# Altium schematic sheet HIVE_BOARD_WIRELESS.SchDoc
size Tabloid; SheetNumber: 11; SheetTotal: 12; Sheet_Name: WIRELESS; Size: 11x17
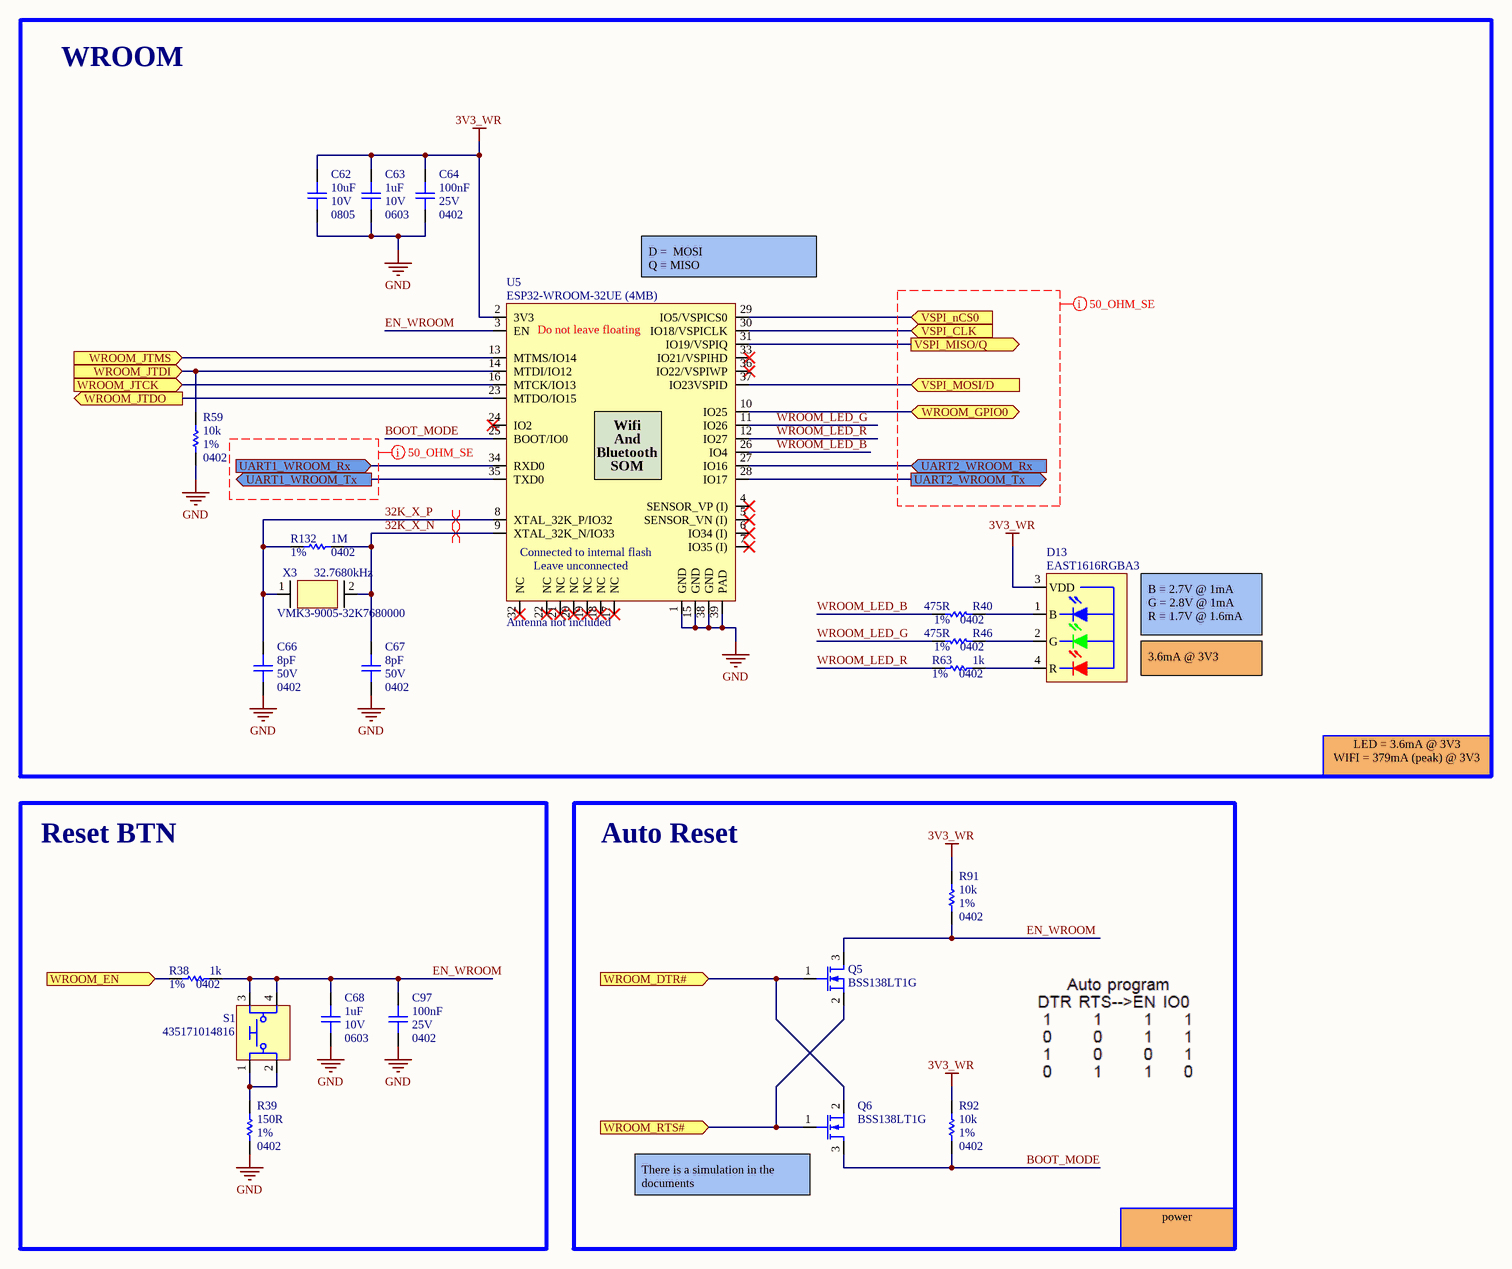
[diagram p0: HIVE_BOARD_WIRELESS.SchDoc]

## Parts
C62  value 10uF  Package: 0805  Voltage Rating: 10V  [CAP_CER_0805]  (hidden comment: LMK212BJ106KG-T)
C63  value 1uF  Package: 0603  Voltage Rating: 10V  [CAP_CER_0603]  (hidden comment: C0603C105K8PACTU)
C64  value 100nF  Package: 0402  Voltage Rating: 25V  [CAP_CER_0402]  (hidden comment: CGA2B3X7R1E104K050BB)
C66  value 8pF  Package: 0402  Voltage Rating: 50V  [CAP_CER_0402]  (hidden comment: CC0402DRNPO9BN8R0)
C67  value 8pF  Package: 0402  Voltage Rating: 50V  [CAP_CER_0402]  (hidden comment: CC0402DRNPO9BN8R0)
C68  value 1uF  Package: 0603  Voltage Rating: 10V  [CAP_CER_0603]  (hidden comment: C0603C105K8PACTU)
C97  value 100nF  Package: 0402  Voltage Rating: 25V  [CAP_CER_0402]  (hidden comment: CGA2B3X7R1E104K050BB)
D13  EAST1616RGBA3  [DIO_EAST1616RGBA3]
Q5  BSS138LT1G  [TRX_NMOS_BSS138LT1G]
Q6  BSS138LT1G  [TRX_NMOS_BSS138LT1G]
R38  value 1k  Tolerance: 1%  Package: 0402  [RES_0402]  (hidden comment: RC0402FR-071KL)
R39  value 150R  Tolerance: 1%  Package: 0402  [RES_0402]  (hidden comment: RC0402FR-07150RL)
R40  value 475R  Tolerance: 1%  Package: 0402  [RES_0402]  (hidden comment: ERJ-2RKF4750X)
R46  value 475R  Tolerance: 1%  Package: 0402  [RES_0402]  (hidden comment: ERJ-2RKF4750X)
R59  value 10k  Tolerance: 1%  Package: 0402  [RES_0402]  (hidden comment: RC0402FR-0710KL)
R63  value 1k  Tolerance: 1%  Package: 0402  [RES_0402]  (hidden comment: RC0402FR-071KL)
R91  value 10k  Tolerance: 1%  Package: 0402  [RES_0402]  (hidden comment: RC0402FR-0710KL)
R92  value 10k  Tolerance: 1%  Package: 0402  [RES_0402]  (hidden comment: RC0402FR-0710KL)
R132  value 1M  Tolerance: 1%  Package: 0402  [RES_0402]  (hidden comment: RC0402FR-071ML)
S1  435171014816  [SWI_TACT_435171014816]
U5  ESP32-WROOM-32UE (4MB)  Note: Antenna not included  [COM_ESP32-WROOM-32UE(8MB)]
X3  VMK3-9005-32K7680000  value 32.7680kHz  [CRY_VMK3-9005-32K7680000]

## Blocks framed on the sheet
WROOM: C62-C64 C66 C67 D13 R40 R46 R59 R63 R132 U5 X3
Reset BTN: C68 C97 R38 R39 S1
Auto Reset: Q5 Q6 R91 R92

## Ports
UART1_WROOM_Rx (in), UART1_WROOM_Tx (out), UART2_WROOM_Rx (in), UART2_WROOM_Tx (out), VSPI_CLK (in), VSPI_MISO/Q (out), VSPI_MOSI/D (in), VSPI_nCS0 (in), WROOM_DTR# (in), WROOM_EN (in), WROOM_GPIO0 (bidir), WROOM_JTCK (in), WROOM_JTDI (in), WROOM_JTDO (out), WROOM_JTMS (in), WROOM_RTS# (in)

## Nets
3V3_WR: C62.2 C63.1 C64.2 D13.3(VDD) R91.2 R92.2 U5.2(3V3)
GND: C62.1 C63.2 C64.1 C66.1 C67.1 C68.2 C97.1 R39.1 R59.1 U5.1(GND) U5.15(GND) U5.38(GND) U5.39(PAD)
32K_X_N: C67.2 R132.1 U5.9(XTAL_32K_N/IO33) X3.2(Out/In)
32K_X_P: C66.2 R132.2 U5.8(XTAL_32K_P/IO32) X3.1(In/Out)
BOOT_MODE: Q6.3(D) R92.1 U5.25(BOOT/IO0)
EN_WROOM: C68.1 C97.2 Q5.3(D) R38.1 R91.1 S1.3 S1.4 U5.3(EN)
UART1_WROOM_Rx: U5.34(RXD0) ; port UART1_WROOM_Rx
UART1_WROOM_Tx: U5.35(TXD0) ; port UART1_WROOM_Tx
UART2_WROOM_Rx: U5.27(IO16) ; port UART2_WROOM_Rx
UART2_WROOM_Tx: U5.28(IO17) ; port UART2_WROOM_Tx
VSPI_CLK: U5.30(IO18/VSPICLK) ; port VSPI_CLK
VSPI_MISO/Q: U5.31(IO19/VSPIQ) ; port VSPI_MISO/Q
VSPI_MOSI/D: U5.37(IO23VSPID) ; port VSPI_MOSI/D
VSPI_nCS0: U5.29(IO5/VSPICS0) ; port VSPI_nCS0
WROOM_DTR#: Q5.1(G) Q6.2(S) ; port WROOM_DTR#
WROOM_EN: R38.2 ; port WROOM_EN
WROOM_GPIO0: U5.10(IO25) ; port WROOM_GPIO0
WROOM_JTCK: U5.16(MTCK/IO13) ; port WROOM_JTCK
WROOM_JTDI: R59.2 U5.14(MTDI/IO12) ; port WROOM_JTDI
WROOM_JTDO: U5.23(MTDO/IO15) ; port WROOM_JTDO
WROOM_JTMS: U5.13(MTMS/IO14) ; port WROOM_JTMS
WROOM_LED_B: R40.2 U5.26(IO4)
WROOM_LED_G: R46.2 U5.11(IO26)
WROOM_LED_R: R63.2 U5.12(IO27)
WROOM_RTS#: Q5.2(S) Q6.1(G) ; port WROOM_RTS#
NetD13_1: D13.1(B) R40.1
NetD13_2: D13.2(G) R46.1
NetD13_4: D13.4(R) R63.1
NetR39_2: R39.2 S1.1 S1.2

Not connected (* = marked no-connect by the designer): U5 4(SENSOR_VP_(I))* 5(SENSOR_VN_(I))* 6(IO34_(I))* 7(IO35_(I))* 17(NC)* 18(NC)* 19(NC)* 20(NC)* 21(NC)* 22(NC)* 24(IO2)* 32(NC)* 33(IO21/VSPIHD)* 36(IO22/VSPIWP)*

## Layout directives
differential pair; differential pair class DIFF_100: 32K_X_N, 32K_X_P
net class SE_50: (no net found under the mark)

## Notes on the sheet
- (near U5) D =  MOSI
  Q = MISO
- B = 2.7V @ 1mA
  G = 2.8V @ 1mA
  R = 1.7V @ 1.6mA
- 3.6mA @ 3V3
- LED = 3.6mA @ 3V3
  WIFI = 379mA (peak) @ 3V3
- (near Q6) There is a simulation in the documents
- power
- Sheet Name
- Project Title
- Global Project
- Size
- Date
- Group
- Sheet
- Revision
- of
- PCB
- .
- SCH
- Filename
- Designers
- (in symbol COM_ESP32-WROOM-32UE(4MB)) Do not leave floating; Wifi; And; Bluetooth; SOM; Connected to internal flash; Leave unconnected

## Library data of the parts
C62 = CAP_CER_LMK212BJ106KG-T: CAP - CER 10UF 10% 10V X5R - 0805; Manufacturer #1: Taiyo Yuden; GRAMS Lib Spec: 2.8; Magnetic Material: Unknown; Polarized: NO; Assembly Type: SMD; CreatedBy/Date: Caroline Paulin / 25 juillet 2018; Current Rating: *; HelpURL: https://www.yuden.co.jp/productdata/catalog/mlcc_all_e.pdf; Manufacturer #2: *; Note: *; Part Number #1: LMK212BJ106KG-T; Part Number #2: *; Power Max: *; Temperature: -55°C ~ 85°C; Tolerance: 10%; VerifiedBy: Nicolas V. (2019-01-22); Supplier 1: Digi-Key; Supplier Part Number 1: 587-1300-1-ND; Cryo: UNKNOWN
C63 C68 = CAP_CER_C0603C105K8PACTU: CAP - CER 1uF 10V 10% X5R - 0603; Manufacturer #1: KEMET; GRAMS Lib Spec: 2.8; Magnetic Material: Unknown; Polarized: NO; Tolerance: 10%; Current Rating: *; Power Max: *; HelpURL: https://content.kemet.com/datasheets/KEM_C1006_X5R_SMD.pdf; CreatedBy/Date: Hubert Dube - 21/07/20; VerifiedBy: Louis-Daniel Gaulin - 21/07/20; Temperature: -55°C ~ 85°C; Manufacturer #2: *; Assembly Type: SMD; Part Number #2: *; Part Number #1: C0603C105K8PACTU; Cryo: UNKNOWN; Supplier 1: Digi-Key; Supplier Part Number 1: 399-3118-1-ND
C64 C97 = CAP_CER_CGA2B3X7R1E104K050BB: CAP - CER 0.1µF 10% 25V X7R - 0402; Manufacturer #1: TDK Corporation; GRAMS Lib Spec: 2.8; Magnetic Material: Unknown; Polarized: NO; Assembly Type: SMD; CreatedBy/Date: Nicolas Roy 2018-11-07; Current Rating: *; HelpURL: https://product.tdk.com/info/en/catalog/datasheets/mlcc_automotive_general_en.pdf; Manufacturer #2: *; Note: *; Part Number #1: CGA2B3X7R1E104K050BB; Part Number #2: *; Power Max: *; Temperature: -55°C ~ 125°C; Tolerance: 10%; VerifiedBy: Nicolas V. (2019-01-22); Supplier 1: Digi-Key; Supplier Part Number 1: 445-6902-1-ND; Cryo: UNKNOWN
C66 C67 = CAP_CER_CC0402DRNPO9BN8R0: CAP - CER 8PF 50V C0G/NP0 - 0402; Manufacturer #1: Yageo; Tolerance: ±0.5pF; GRAMS Lib Spec: 2.8; Magnetic Material: Unknown; Polarized: NO; Current Rating: *; Power Max: *; HelpURL: https://www.yageo.com/upload/media/product/productsearch/datasheet/mlcc/UPY-GP_NP0_16V-to-50V_18.pdf; CreatedBy/Date: Hubert Dube - 04/10/20; VerifiedBy: Louis-Daniel Gaulin - 09/11/2020; Temperature: -55°C ~ 125°C; Manufacturer #2: *; Assembly Type: SMD; Part Number #2: *; Part Number #1: CC0402DRNPO9BN8R0; Cryo: UNKNOWN; Supplier 1: Digi-Key; Supplier Part Number 1: 311-1639-1-ND
D13 = DIO_EAST1616RGBA3: DIO - Red, Green, Blue LED Indication - Discrete 1.95V Red, 2.8V Green, 2.8V Blue 0606 (1616 Metric); Manufacturer #1: Everlight Electronics Co Ltd; Value: 24MHz; Tolerance: ±50ppm; Voltage Rating: 1.8 to 3.3V; Current Rating: 60mA; Power Max: 60mW; GRAMS Lib Spec: 2.8; Magnetic Material: Unknown; Polarized: Yes; HelpURL: https://everlightamericas.com/index.php?controller=attachment&id_attachment=1010; CreatedBy/Date: Hubert Dube - 26/02/2021; VerifiedBy: PA + Hubert Dube - 19/03/2021; Temperature: -40 ~ +85℃; Package: 4-SMD, No Lead; Manufacturer #2: *; Note: *; Assembly Type: SMD; Part Number #2: *; Part Number #1: EAST1616RGBA3; Cryo: UNKNOWN; Supplier 1: Digi-Key; Supplier Part Number 1: 1080-1550-1-ND
Q5 Q6 = TRX_NMOS_BSS138LT1G: TRX - NMOS - 50V 200MA - SOT−23-3; Manufacturer #1: ON Semiconductor; GRAMS Lib Spec: 2.8; Magnetic Material: Unknown; Polarized: Yes; Power Max: 225mW; Assembly Type: SMD; CreatedBy/Date: Joel Lemay 2018-06-15; Current Rating: 200mA; HelpURL: http://www.onsemi.com/pub/Collateral/BSS138LT1-D.PDF; Manufacturer #2: *; Package: SOT-23-3; Part Number #1: BSS138LT1G; Part Number #2: *; Supplier 1: Digi-Key; Supplier Part Number 1: BSS138LT1GOSCT-ND; Temperature: -55°C ~ 150°C; Tolerance: *; Value: *; VerifiedBy: Caroline Paulin - 6 sept 2018; Voltage Rating: 50V; Cryo: UNKNOWN
R38 R63 = RES_RC0402FR-071KL: RES - 1K OHM 1% 1/16W - 0402; Manufacturer #1: Yageo; GRAMS Lib Spec: 2.8; Magnetic Material: YES; Polarized: NO; Voltage Rating: 50V; Cryo: UNKNOWN; Assembly Type: SMD; CreatedBy/Date: Jonathan Bouchard 2018-07-05; Current Rating: *; HelpURL: http://www.yageo.com/documents/recent/PYu-RC_Group_51_RoHS_L_9.pdf; Manufacturer #2: *; Note: *; Part Number #1: RC0402FR-071KL; Part Number #2: *; Power Max: 1/16W; Temperature: -55°C ~ 155°C; VerifiedBy: Arnaud Samson 16-07-18; Supplier 1: Digi-Key; Supplier Part Number 1: 311-1.00KLRCT-ND
R39 = RES_RC0402FR-07150RL: RES - 150R 1% 1/16W - 0402; Manufacturer #1: Yageo; GRAMS Lib Spec: 2.8; Magnetic Material: Unknown; Polarized: No; Voltage Rating: 50V; Assembly Type: SMD; CreatedBy/Date: Jonathan Bouchard 2019-03-25; Current Rating: *; HelpURL: http://www.yageo.com/documents/recent/PYu-RC_Group_51_RoHS_L_10.pdf; Manufacturer #2: *; Part Number #1: RC0402FR-07150RL; Part Number #2: *; Power Max: 1/16W; Temperature: -55°C ~ 155°C; VerifiedBy: Nicolas V. (2019-05-02); Supplier 1: Digi-Key; Supplier Part Number 1: 311-150LRCT-ND; Cryo: UNKNOWN
R40 R46 = RES_ERJ-2RKF4750X: RES - 475R 1% 1/10W- 0402; Manufacturer #1: Panasonic Electronic Components; GRAMS Lib Spec: 2.8; Power Max: 1/10W; Magnetic Material: Unknown; Polarized: No; Voltage Rating: 50V; Assembly Type: SMD; CreatedBy/Date: Keven Deslandes 2018-10-17; Current Rating: *; HelpURL: https://industrial.panasonic.com/cdbs/www-data/pdf/RDA0000/AOA0000C304.pdf; Manufacturer #2: *; Part Number #1: ERJ-2RKF4750X; Part Number #2: *; Temperature: -55°C ~ 155°C; VerifiedBy: Carolilne Paulin - 18/12/2018; Supplier 1: Digi-Key; Supplier Part Number 1: P475LCT-ND; Cryo: UNKNOWN
R59 R91 R92 = RES_RC0402FR-0710KL: RES - 10K OHMS 1% 1/16W - 0402; Manufacturer #1: Yageo; GRAMS Lib Spec: 2.8; Magnetic Material: UNKNOWN; Polarized: NO; Voltage Rating: 50V; Assembly Type: SMD; CreatedBy/Date: Nicolas V. (2018-11-20); Current Rating: *; HelpURL: http://www.yageo.com/documents/recent/PYu-RC_Group_51_RoHS_L_9.pdf; Manufacturer #2: *; Note: *; Part Number #1: RC0402FR-0710KL; Part Number #2: *; Power Max: 1/16W; Temperature: -55°C ~ 155°C; VerifiedBy: Nicolas V. (2018-11-20); Supplier 1: Digi-Key; Supplier Part Number 1: 311-10.0KLRCT-ND; Cryo: UNKNOWN
R132 = RES_RC0402FR-071ML: RES - 1M 1% 1/16W - 0402; Manufacturer #1: Yageo; GRAMS Lib Spec: 2.8; Magnetic Material: Unknown; Polarized: No; Voltage Rating: 50V; Assembly Type: SMD; CreatedBy/Date: Keven Deslandes 2018-11-09; Current Rating: *; HelpURL: http://www.yageo.com/documents/recent/PYu-RC_Group_51_RoHS_L_10.pdf; Manufacturer #2: *; Part Number #1: RC0402FR-071ML; Part Number #2: *; Power Max: 1/16W; Temperature: -55°C ~ 155°C; VerifiedBy: Caroline Paulin - 7 janv 2019; Supplier 1: Digi-Key; Supplier Part Number 1: 311-1.00MLRCT-ND; Cryo: UNKNOWN
S1 = SWI_TACT_435171014816: SWI - SWITCH TACTILE SPST-NO 0.05A 12V -SMD; Manufacturer #1: Würth Elektronik; Current Rating: 50mA; Voltage rating: 12VDC; Polarized: No; Magnetic Material: UNKNOWN; GRAMS Lib Spec: 2.8; Manufacturer #2: *; Power Max: *; Value: SPST-NO; Part Number #1: 435171014816; Part Number #2: *; HelpURL: https://www.we-online.com/catalog/datasheet/435171014816.pdf; Supplier 1: Digi-Key; Supplier Part Number 1: 732-435171014816CT-ND; Assembly Type: SMD; Temperature: -40°C ~ 85°C; Package: SMD; CreatedBy/Date: Hubert Dube - 22/07/20; Tolerance: *; VerifiedBy: Louis-Daniel Gaulin / 12-11-2020; Cryo: UNKNOWN
U5 = COM_ESP32-WROOM-32UE(4MB): Bluetooth, WiFi 802.11b/g/n, Bluetooth v4.2 +EDR, Class 1, 2 and 3 Transceiver Module 2.4GHz ~ 2.5GHz Antenna Not Included, U.FL Surface Mount; Manufacturer #1: Espressif Systems; Voltage Rating: -0.3 to 3.6V; Current Rating: 1100mA; Power Max: 3.96W; GRAMS Lib Spec: 2.7; Magnetic Material: Unknown; Polarized: Yes; Value: *; Tolerance: *; HelpURL: https://www.espressif.com/sites/default/files/documentation/esp32-wroom-32e_esp32-wroom-32ue_datasheet_en.pdf; VerifiedBy: Philippe Arsenault/ 2021-03-11; Temperature: -40~85C; Package: 38-SMD MODULE; Manufacturer #2: *; Assembly Type: SMD; Part Number #2: *; Part Number #1: ESP32-WROOM-32UE (4MB); CreatedBy/Date: Hubert Dube -  25/02/2021; Supplier 1: Digi-Key; Supplier Part Number 1: 1965-ESP32-WROOM-32UE(4MB)TR-ND
X3 = CRY_VMK3-9005-32K7680000: CRY - 32.768KHZ tol:20ppm  - 2-SMD; Manufacturer #1: Microchip Technology; Magnetic Material: Unknown; Note: The capacitance is unclear - migthcause problems; Polarized: No; GRAMS Lib Spec: 2.8c; Tolerance: ±20ppm; Assembly Type: SMD; Current Rating: *; Manufacturer #2: *; Part Number #1: VMK3-9005-32K7680000; Part Number #2: *; Package: 2-SMD, No Lead; Power Max: *; Voltage rating: *; Temperature: -40°C ~ 85°C; HelpURL: https://www.vectron.com/products/crystals/VMK3_VMK4.pdf; CreatedBy/Date: Louis-Daniel Gaulin / 08-04-2021; VerifiedBy: Philippe Arsenault/2021-04-15; Cryo: UNKNOWN; Supplier 1: Digi-Key; Supplier Part Number 1: 150-VMK3-9005-32K7680000CT-ND